# Altium schematic sheet CON_MEZZANINE_ANALOG.SchDoc: Mezzanine con analog
size 420 x 297 mm; Author: G.Kasprowicz; CompanyName: WUT ISE; DrawnBy: G.Kasprowicz; Organization: WUT ISE; Address1: PW ISE; Address2: Nowowiejska 15/19 00-665 Warsaw; Address3: gkasprow@gmail.com; DocumentNumber: 21; Revision: 1.0; SheetNumber: 21; SheetTotal: 37; ModifiedBy: -; CheckedDate: -; DivGrp: WUT ISE; Designer: G.Kasprowicz; Title2: Fast Stabilizer; ModifiedDate: -; ProjectName: Sensor Box
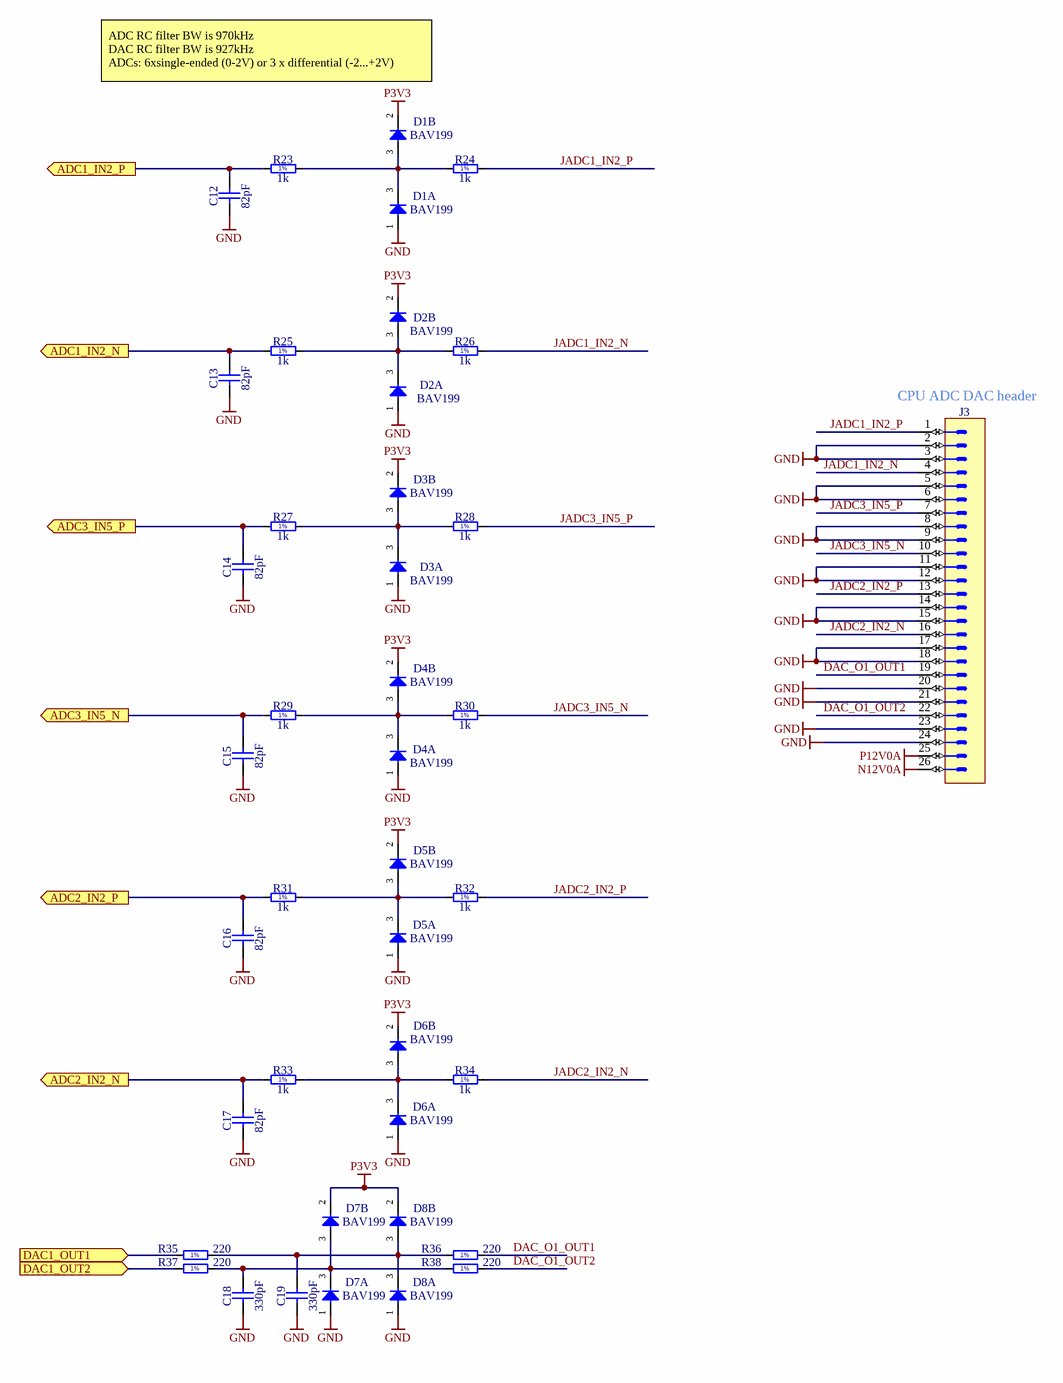
[diagram p0: CON_MEZZANINE_ANALOG.SchDoc]

## Parts
C12  82pF  [CAPC1608X87N]
C13  82pF  [CAPC1608X87N]
C14  82pF  [CAPC1608X87N]
C15  82pF  [CAPC1608X87N]
C16  82pF  [CAPC1608X87N]
C17  82pF  [CAPC1608X87N]
C18  330pF  [CAPC1608X87N]
C19  330pF  [CAPC1608X87N]
D1  BAV199  [SOT95P240X110-3N]  (parts A,B of 2)
D2  BAV199  [SOT95P240X110-3N]  (parts A,B of 2)
D3  BAV199  [SOT95P240X110-3N]  (parts A,B of 2)
D4  BAV199  [SOT95P240X110-3N]  (parts A,B of 2)
D5  BAV199  [SOT95P240X110-3N]  (parts A,B of 2)
D6  BAV199  [SOT95P240X110-3N]  (parts A,B of 2)
D7  BAV199  [SOT95P240X110-3N]  (parts A,B of 2)
D8  BAV199  [SOT95P240X110-3N]  (parts A,B of 2)
J3  Header 26  [3M_N2526-6002RB]  (value not drawn)
R23  1k  [RESC1005X40N]
R24  1k  [RESC1005X40N]
R25  1k  [RESC1005X40N]
R26  1k  [RESC1005X40N]
R27  1k  [RESC1005X40N]
R28  1k  [RESC1005X40N]
R29  1k  [RESC1005X40N]
R30  1k  [RESC1005X40N]
R31  1k  [RESC1005X40N]
R32  1k  [RESC1005X40N]
R33  1k  [RESC1005X40N]
R34  1k  [RESC1005X40N]
R35  220  [RESC1608X55N]
R36  220  [RESC1608X55N]
R37  220  [RESC1608X55N]
R38  220  [RESC1608X55N]

## Ports
ADC1_IN2_N (out), ADC1_IN2_P (out), ADC2_IN2_N (out), ADC2_IN2_P (out), ADC3_IN5_N (out), ADC3_IN5_P (out), DAC1_OUT1 (in), DAC1_OUT2 (in)

## Nets
GND: C12.1 C13.1 C14.1 C15.1 C16.1 C17.1 C18.1 C19.1 D1.1(A) D2.1(A) D3.1(A) D4.1(A) D5.1(A) D6.1(A) D7.1(A) D8.1(A) J3.2 J3.3 J3.5 J3.6 J3.8 J3.9 J3.11 J3.12 J3.14 J3.15 J3.17 J3.18 J3.20 J3.21 J3.23 J3.24
N12V0A: J3.26
P3V3: D1.2(C) D2.2(C) D3.2(C) D4.2(C) D5.2(C) D6.2(C) D7.2(C) D8.2(C)
P12V0A: J3.25
ADC1_IN2_N: C13.2 R25.1 ; port ADC1_IN2_N
ADC1_IN2_P: C12.2 R23.1 ; port ADC1_IN2_P
ADC2_IN2_N: C17.2 R33.1 ; port ADC2_IN2_N
ADC2_IN2_P: C16.2 R31.1 ; port ADC2_IN2_P
ADC3_IN5_N: C15.2 R29.1 ; port ADC3_IN5_N
ADC3_IN5_P: C14.2 R27.1 ; port ADC3_IN5_P
DAC1_OUT1: R35.1 ; port DAC1_OUT1
DAC1_OUT2: R37.1 ; port DAC1_OUT2
DAC_O1_OUT1: J3.19 R36.2
DAC_O1_OUT2: J3.22 R38.2
JADC1_IN2_N: J3.4 R26.2
JADC1_IN2_P: J3.1 R24.2
JADC2_IN2_N: J3.16 R34.2
JADC2_IN2_P: J3.13 R32.2
JADC3_IN5_N: J3.10 R30.2
JADC3_IN5_P: J3.7 R28.2
NetC18_2: C18.2 D7.3(COMAC) R37.2 R38.1
NetC19_2: C19.2 D8.3(COMAC) R35.2 R36.1
NetD1_3: D1.3(COMAC) R23.2 R24.1
NetD2_3: D2.3(COMAC) R25.2 R26.1
NetD3_3: D3.3(COMAC) R27.2 R28.1
NetD4_3: D4.3(COMAC) R29.2 R30.1
NetD5_3: D5.3(COMAC) R31.2 R32.1
NetD6_3: D6.3(COMAC) R33.2 R34.1

## Notes on the sheet
- (near D1) ADC RC filter BW is 970kHz
  DAC RC filter BW is 927kHz
  ADCs: 6xsingle-ended (0-2V) or 3 x differential (-2...+2V)
- (near J3) CPU ADC DAC header
- Project/Equipment
- Document
- Designer
- Drawn by
- Check.by
- Copyright WUT ISE 2020.
  This documentation describes Open Hardware and is licensed under the CERN OHL v.1.2. You may redistribute and modify this documentation under the terms of the CERN OHL v.1.2. (http://ohwr.org/CERNOHL). This documentation is distributed WITHOUT ANY EXPRESS OR IMPLIED WARRANTY, INCLUDING OF MERCHANTABILITY, SATISFACTORY QUALITY AND FITNESS FOR A PARTICULAR PURPOSE. Please see the CERN OHL v.1.2 for applicable conditions.
- Contact
- File
- Last Mod.
- Print Date
- Sheet
- Size
- A3
- of
- Rev
- (in symbol R0402_1K_1%_0.0625W_100PPM) 1%
- (in symbol R0603_220R_1%_0.1W_100PPM) 1%

## Library data of the parts
C12-C17 = CC0603_82PF_50V_5%_NP0: Non-polarised capacitor; Part Description: SMD Multilayer Chip Ceramic Capacitor; Manufacturer: GENERIC; Manufacturer1 Part Number: 223886715829; Voltage: 50V; TC: C0G/NP0; Tolerance: ±5%; Part Number: CC0603_82PF_50V_5%_NP0; Component Kind: Standard; Component Type: Standard; Pin Count: 2; Value: 82pF; Status: Preferred; Manufacturer Part Number: CC0603_82PF_50V_5%_NP0; Case: 0603; Mounted: Yes; Socket: No; SMD: Yes; Sense: No; Manufacturer1 Example: PHYCOMP; Manufacturer1 ComponentHeight: 0.87mm; HelpURL: \\cern.ch\dfs\Applications\Altium\Datasheets\CC0603_NP0_PHYCOMP.pdf; Author: CERN DEM JLC; CreateDate: 03.12.2007; LatestRevisionDate: 03.12.2007
C18 C19 = CC0603_330PF_50V_1%_NP0: Non-polarised capacitor; Part Description: SMD Multilayer Chip Ceramic Capacitor; Manufacturer: GENERIC; Manufacturer1 Part Number: 223886718331; Voltage: 50V; TC: C0G/NP0; Tolerance: ±1%; Part Number: CC0603_330PF_50V_1%_NP0; Component Kind: Standard; Component Type: Standard; Pin Count: 2; Value: 330pF; Status: None; Manufacturer Part Number: CC0603_330PF_50V_1%_NP0; Case: 0603; Mounted: Yes; Socket: No; SMD: Yes; Sense: No; Manufacturer1 Example: PHYCOMP; Manufacturer1 ComponentHeight: 0.87mm; HelpURL: \\cern.ch\dfs\Applications\Altium\Datasheets\CC0603_NP0_PHYCOMP.pdf; Author: CERN DEM MR; CreateDate: 06.09.2017; LatestRevisionDate: 06.09.2017
D1-D8 = BAV199: Serial Diode; Part Description: Low-Leakage Double Diode; Manufacturer: NXP SEMICONDUCTORS; Voltage: 75V; Power: 250mW; PressFit: No; Bonding: No; Part Number: BAV199; Component Kind: Standard; Component Type: Standard; Device: BAV199; PackageDescription: SOT23 3-Leads, Pitch 0.95mm - Body 1.4x3mm, IPC Medium Density; Manufacturer Part Number: BAV199; Pin Count: 3; Case: SOT23-3; Mounted: Yes; Socket: No; SMD: Yes; Sense: No; ComponentHeight: 1.1mm; HelpURL: \\cern.ch\dfs\Applications\Altium\Datasheets\BAV199.pdf; Author: CERN DEM JMW; CreateDate: 2008-11-21; LatestRevisionDate: 2008-11-21
J3 = 3M_N2526-6002RB: Connector 26 Male; Part Description: 26 Contacts - Straight .100'' x .100'' Low Profile Four-Wall Header, 2500 Series; Manufacturer: 3M; PressFit: No; Part Number: 3M_N2526-6002RB; Component Kind: Standard; Component Type: Standard; Pin Count: 26; Family: Header 26; Mounted: Yes; Socket: No; SMD: No; Sense: No; Status: None; Manufacturer Part Number: N2526-6002RB; ComponentHeight: 10.03mm; HelpURL: \\cern.ch\dfs\Applications\Altium\Datasheets\3M_N2526-6002RB.pdf; Author: CERN DEM JLC; CreateDate: 11.02.2009; LatestRevisionDate: 11.08.2009
R23-R34 = R0402_1K_1%_0.0625W_100PPM: Resistor - 1%; Part Description: General Purpose Thick Film Chip Resistor; Manufacturer: GENERIC; Manufacturer1 Part Number: 232270671002L; TC: ±100ppm/°C; PressFit: No; Part Number: R0402_1K_1%_0.0625W_100PPM; Component Kind: Standard; Component Type: Standard; Pin Count: 2; Value: 1k; Status: Not Recommended; Power: 0.0625W; Tolerance: ±1%; Manufacturer Part Number: R0402_1K_1%_0.0625W_100PPM; Case: 0402; Mounted: Yes; Sense: No; Socket: No; SMD: Yes; Manufacturer1 Example: YAGEO PHYCOMP; Manufacturer1 ComponentHeight: 0.4mm; HelpURL: \\cern.ch\dfs\Applications\Altium\Datasheets\R0402_Phycomp_RC0402.pdf; Author: CERN DEM JLC; CreateDate: 03/12/2007; LatestRevisionDate: 17/10/2012
R35-R38 = R0603_220R_1%_0.1W_100PPM: Resistor - 1%; Part Description: General Purpose Thick Film Chip Resistor; Manufacturer: GENERIC; Manufacturer1 Part Number: NRC06F2200TRF; Power: 0.1W; TC: ±100ppm/°C; PressFit: No; Part Number: R0603_220R_1%_0.1W_100PPM; Component Kind: Standard; Component Type: Standard; Pin Count: 2; Value: 220; Status: Preferred; Tolerance: ±1%; Manufacturer Part Number: R0603_220R_1%_0.1W_100PPM; Case: 0603; Mounted: Yes; Sense: No; Socket: No; SMD: Yes; Manufacturer1 Example: NIC COMPONENT; Manufacturer1 ComponentHeight: 0.55mm; HelpURL: \\cern.ch\dfs\Applications\Altium\Datasheets\R0603_NIC_NRC.pdf; Author: CERN DEM JLC; CreateDate: 03/12/2007; LatestRevisionDate: 13/03/2008